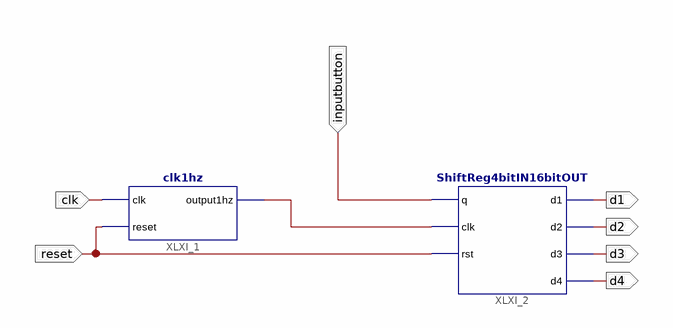
[diagram p0: schematic sheet 1]
// Xilinx ISE schematic top.sch (spartan3e) as structural Verilog: 2 symbols, 7 ports
module top (
  input  reset,
  input  inputbutton,
  input  clk,
  output d1,
  output d2,
  output d3,
  output d4
);

  wire XLXN_3;

  clk1hz XLXI_1 (.clk(clk), .reset(reset), .output1hz(XLXN_3));
  ShiftReg4bitIN16bitOUT XLXI_2 (.q(inputbutton), .clk(XLXN_3), .rst(reset), .d1(d1), .d2(d2), .d3(d3), .d4(d4));
endmodule
